# EAGLE design ASL1201 (EAGLE 6.2)
DATABASE: ./../../../../../Components/TinyCircuits_Part_Database.txt
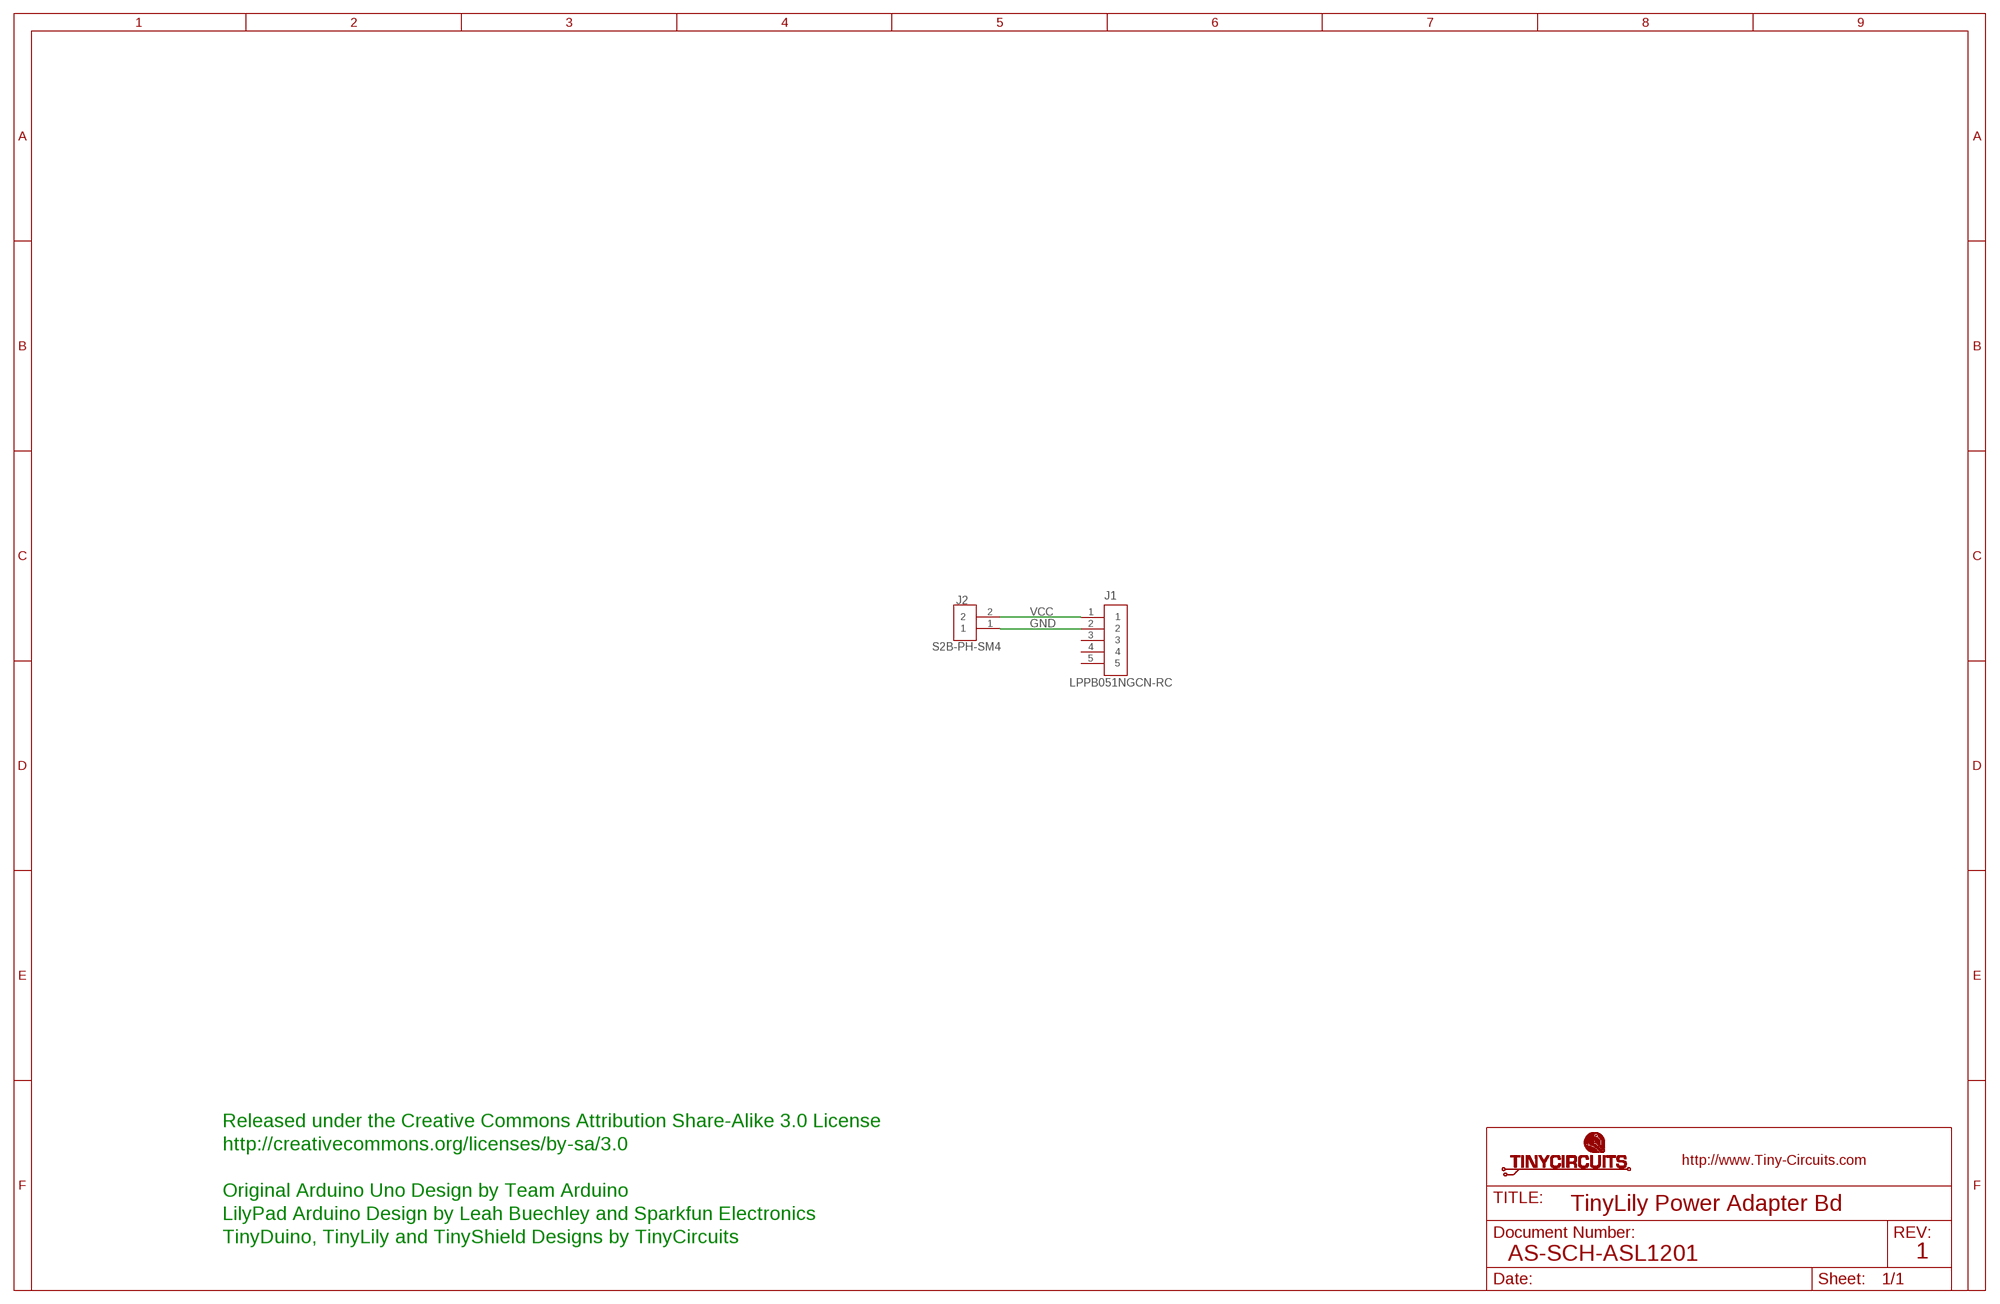
[diagram p0: schematic, sheet 1]

## Parts
J1  LPPB051NGCN-RC  AS-ITM-00037  [1X5_.05_RA_TH_RECPT]
J2  S2B-PH-SM4  AS-ITM-00043  [JST_PH_2]

## Nets
GND: J1.2 J2.1
VCC: J1.1 J2.2
Unconnected: J1.3 J1.4 J1.5

## Notes on the sheet
- Released under the Creative Commons Attribution Share-Alike 3.0 License
- http://creativecommons.org/licenses/by-sa/3.0
- Original Arduino Uno Design by Team Arduino
- TinyLily Power Adapter Bd
- LilyPad Arduino Design by Leah Buechley and Sparkfun Electronics
- TinyDuino, TinyLily and TinyShield Designs by TinyCircuits
- AS-SCH-ASL1201 | 1

## Library data of the parts
J1 = tinycircuits:AS-ITM-00037: CONN HEADER .050" 5POS TH RA RECPT; PARTNO: AS-ITM-00037
J2 = tinycircuits:AS-ITM-00043: CONN HEADER PH SIDE 2POS 2MM SMD; PARTNO: AS-ITM-00043

## Net classes
2 gnd: width 0.305 mm, drill 0.559 mm, clearance 0.254 mm

## Board
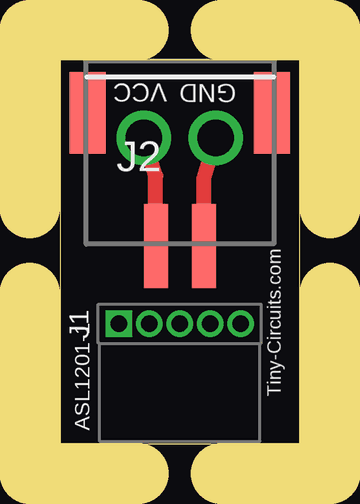
[diagram p1: board, top side]
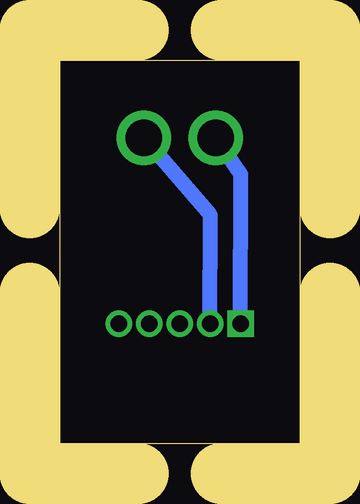
[diagram p2: board, bottom side, seen from below]

Size 10 x 16 mm. Coordinates in mm from the lower left corner, seen from the top.
Outline: 0,0 10,0 10,16 0,16 0,0
Copper layers (1*16): Top 0.035mm / dielectric 1.5mm / Bottom 0.035mm
Design rules: minimum track width 8mil, minimum drill 15mil, track to track 6mil, track to pad 6mil, pad to pad 6mil, via to via 6mil, smd to smd 6mil, copper to edge 6mil, drill to drill 8mil, minimum pad ring 8mil, minimum via ring 5mil, stop-mask expansion 4mil, vias tented up to drill 25mil, thermal gap 10mil
Milling: 10 lines

### Footprints (pad centres in the part's own frame; a part is rotated, then mirrored left to right if it is on the bottom)
1X5_.05_RA_TH_RECPT = drill 0.7 pad 1.016 square: 1 0,2.54 | drill 0.7 pad 1.016: 2 0,1.27; 3 0,0; 4 0,-1.27; 5 0,-2.54
JST_PH_2 = smd 1 x 3.5: 1 1,-2.75; 2 -1,-2.75 | smd 1.5 x 3.4: F1 -3.85,2.8; F2 3.85,2.8

### Placement (x,y rotation side)
J1  5,5 90 top
J2  5,11 0 top
U$1  [DOCFIELD-TINYCIRCUITS-PCB]  29,-13 0 top  (outside the outline)

### Tracks (layer width: path | path; a pad name or v marks a point on that pad's centre or on a via)
GND  (via drill 1.52)
  Top 0.635: J2.1 6.01,11.05 v6.5,12.75
  Bottom 0.635: J1.2 3.72,9.52 v6.5,12.75
VCC  (via drill 1.52)
  Top 0.635: J2.2 4,11.17 v3.5,12.75
  Bottom 0.635: J1.1 2.45,11.23 v3.5,12.75

### Text on the board
tPlace: VCC | GND | Tiny-Circuits.com | ASL1201-1
Document: FABRICATION DRAWING | NOTES: | 1. PRINTED CIRCUIT BOARD MADE FROM NEMA GRADE FR-4 EPOXY LAMINATE | WITH 1 OUNCE COPPER PLATING AND .024 THICKNESS. | 2. ALL DIMENSIONS ARE GIVEN IN INCHES. | 3. CIRCUIT PATHS ARE FOR REFERENCE ONLY. | 4. HOLE SIZES SHOWN ARE FINISHED DIAMETERS AFTER PLATING. | 5. BOARD PLATED USING REFLOW OR SIMILAR METHOD. | 6. BOARD TO HAVE BLUE SOLDER MASK ON PLATED SURFACES USING WET FILM | 7. SILKSCREEN BOARD USING WHITE INK. | SR100 OR SR1010 EPOXY. EQUIVALENT WET OR DRY FILM MAY BE USED. | 8. THE FOLLOWING INFORMATION APPLIES TO THIS BOARD: | * 2 COPPER LAYERS | * .024 BOARD THICKNESS | * REQUIRES TOP SIDE SILKSCREEN | Released under the Creative Commons Attribution Share-Alike 3.0 License | http://creativecommons.org/licenses/by-sa/3.0 | Original Arduino Uno Design by Team Arduino | LilyPad Arduino Design by Leah Buechley and Sparkfun Electronics | TinyDuino, TinyLily and TinyShield Designs by TinyCircuits | TinyLily Mini - USB | AS-PCB-ASL1201 | 1